# Altium schematic sheet BUTTON.SchDoc
size A3; SheetNumber: 4; SheetTotal: 7
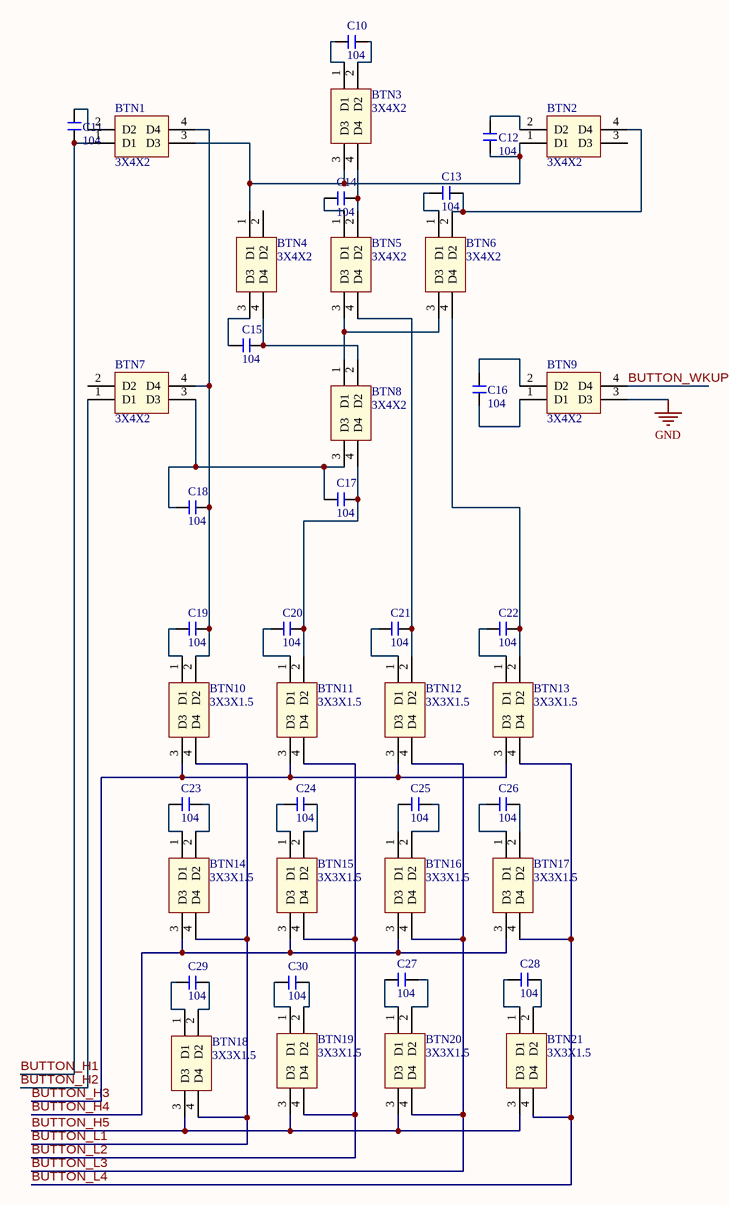
[diagram p0: BUTTON.SchDoc]

## Parts
BTN1  3X4X2  [3X4X2按钮]
BTN2  3X4X2  [3X4X2按钮]
BTN3  3X4X2  [3X4X2按钮]
BTN4  3X4X2  [3X4X2按钮]
BTN5  3X4X2  [3X4X2按钮]
BTN6  3X4X2  [3X4X2按钮]
BTN7  3X4X2  [3X4X2按钮]
BTN8  3X4X2  [3X4X2按钮]
BTN9  3X4X2  [3X4X2按钮]
BTN10  3X3X1.5  [3X3X1.5]
BTN11  3X3X1.5  [3X3X1.5]
BTN12  3X3X1.5  [3X3X1.5]
BTN13  3X3X1.5  [3X3X1.5]
BTN14  3X3X1.5  [3X3X1.5]
BTN15  3X3X1.5  [3X3X1.5]
BTN16  3X3X1.5  [3X3X1.5]
BTN17  3X3X1.5  [3X3X1.5]
BTN18  3X3X1.5  [3X3X1.5]
BTN19  3X3X1.5  [3X3X1.5]
BTN20  3X3X1.5  [3X3X1.5]
BTN21  3X3X1.5  [3X3X1.5]
C10  104  [C 0805_L]
C11  104  [C 0805_L]
C12  104  [C 0805_L]
C13  104  [C 0805_L]
C14  104  [C 0805_L]
C15  104  [C 0805_L]
C16  104  [C 0805_L]
C17  104  [C 0805_L]
C18  104  [C 0805_L]
C19  104  [C 0805_L]
C20  104  [C 0805_L]
C21  104  [C 0805_L]
C22  104  [C 0805_L]
C23  104  [C 0805_L]
C24  104  [C 0805_L]
C25  104  [C 0805_L]
C26  104  [C 0805_L]
C27  104  [C 0805_L]
C28  104  [C 0805_L]
C29  104  [C 0805_L]
C30  104  [C 0805_L]

## Nets
GND: BTN9.3(D3)
BUTTON_H1: BTN1.1(D1) C11.1
BUTTON_H2: BTN7.1(D1)
BUTTON_H3: BTN10.3(D3) BTN11.3(D3) BTN12.3(D3) BTN13.3(D3)
BUTTON_H4: BTN14.3(D3) BTN15.3(D3) BTN16.3(D3) BTN17.3(D3)
BUTTON_H5: BTN18.3(D3) BTN19.3(D3) BTN20.3(D3) BTN21.3(D3)
BUTTON_L1: BTN10.4(D4) BTN14.4(D4) BTN18.4(D4)
BUTTON_L2: BTN11.4(D4) BTN15.4(D4) BTN19.4(D4)
BUTTON_L3: BTN12.4(D4) BTN16.4(D4) BTN20.4(D4)
BUTTON_L4: BTN13.4(D4) BTN17.4(D4) BTN21.4(D4)
BUTTON_WKUP: BTN9.4(D4)
NetBTN1_2: BTN1.2(D2) C11.2
NetBTN1_3: BTN1.3(D3) BTN2.1(D1) BTN3.3(D3) BTN4.1(D1) C12.1
NetBTN1_4: BTN1.4(D4) BTN7.4(D4) BTN10.2(D2) C18.1 C19.1
NetBTN2_2: BTN2.2(D2) C12.2
NetBTN2_4: BTN2.4(D4) BTN6.2(D2) C13.2
NetBTN3_1: BTN3.1(D1) C10.1
NetBTN3_2: BTN3.2(D2) C10.2
NetBTN3_4: BTN3.4(D4) BTN5.2(D2) C14.2
NetBTN4_3: BTN4.3(D3) C15.1
NetBTN4_4: BTN4.4(D4) BTN8.2(D2) C15.2
NetBTN5_1: BTN5.1(D1) C14.1
NetBTN5_3: BTN5.3(D3) BTN6.3(D3) BTN8.1(D1)
NetBTN5_4: BTN5.4(D4) BTN12.2(D2) C21.1
NetBTN6_1: BTN6.1(D1) C13.1
NetBTN6_4: BTN6.4(D4) BTN13.2(D2) C22.1
NetBTN7_3: BTN7.3(D3) BTN8.3(D3) C17.1 C18.2
NetBTN8_4: BTN8.4(D4) BTN11.2(D2) C17.2 C20.1
NetBTN9_1: BTN9.1(D1) C16.1
NetBTN9_2: BTN9.2(D2) C16.2
NetBTN10_1: BTN10.1(D1) C19.2
NetBTN11_1: BTN11.1(D1) C20.2
NetBTN12_1: BTN12.1(D1) C21.2
NetBTN13_1: BTN13.1(D1) C22.2
NetBTN14_1: BTN14.1(D1) C23.2
NetBTN14_2: BTN14.2(D2) C23.1
NetBTN15_1: BTN15.1(D1) C24.2
NetBTN15_2: BTN15.2(D2) C24.1
NetBTN16_1: BTN16.1(D1) C25.1
NetBTN16_2: BTN16.2(D2) C25.2
NetBTN17_1: BTN17.1(D1) C26.2
NetBTN17_2: BTN17.2(D2) C26.1
NetBTN18_1: BTN18.1(D1) C29.2
NetBTN18_2: BTN18.2(D2) C29.1
NetBTN19_1: BTN19.1(D1) C30.2
NetBTN19_2: BTN19.2(D2) C30.1
NetBTN20_1: BTN20.1(D1) C27.2
NetBTN20_2: BTN20.2(D2) C27.1
NetBTN21_1: BTN21.1(D1) C28.2
NetBTN21_2: BTN21.2(D2) C28.1

Not connected (* = marked no-connect by the designer): BTN2 3(D3); BTN4 2(D2); BTN7 2(D2)

## Library data of the parts
C10-C30 = C: 无极性贴片电容; 版权归属: 源创客; 材质: X7R; BOM名称: 无极性贴片电容; 学习资源: www.ooocke.com